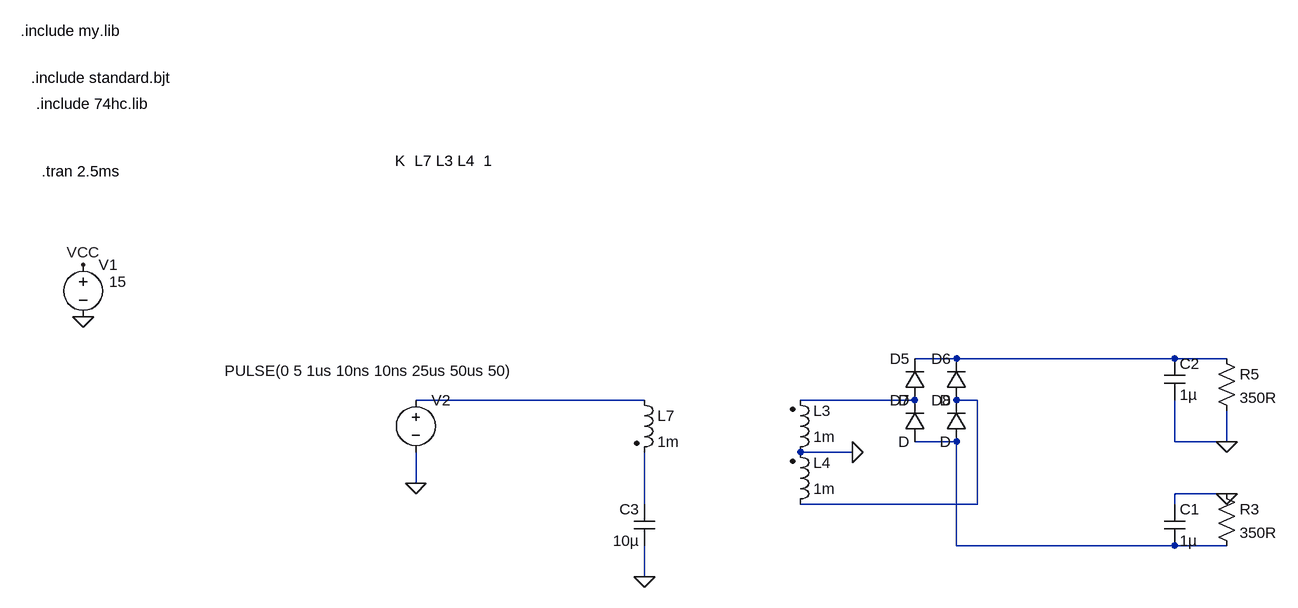
[diagram p0: schematic Draft24.asc]
Draft24.asc, the LTspice schematic file:
Version 4
SHEET 1 5720 1740
WIRE 1984 -192 1920 -192
WIRE 2320 -192 1984 -192
WIRE 2400 -192 2320 -192
WIRE 1504 -128 1152 -128
WIRE 1920 -128 1744 -128
WIRE 2016 -128 1984 -128
WIRE 1984 -64 1920 -64
WIRE 2320 -64 2320 -128
WIRE 2400 -64 2400 -112
WIRE 2400 -64 2320 -64
WIRE 1824 -48 1744 -48
WIRE 1152 0 1152 -48
WIRE 2400 16 2320 16
WIRE 1504 32 1504 -48
WIRE 2016 32 2016 -128
WIRE 2016 32 1744 32
WIRE 2320 32 2320 16
WIRE 1984 96 1984 -64
WIRE 2320 96 1984 96
WIRE 2400 96 2320 96
WIRE 1504 144 1504 96
FLAG 2400 -64 0
FLAG 1824 -48 0
FLAG 2400 16 0
FLAG 640 -256 0
FLAG 640 -336 VCC
FLAG 1504 144 0
FLAG 1152 0 0
SYMBOL ind2 1728 -32 M180
WINDOW 0 36 80 Left 2
WINDOW 3 36 40 Left 2
SYMATTR InstName L3
SYMATTR Value 1m
SYMATTR Type ind
SYMBOL diode 1936 -128 R180
WINDOW 0 24 64 Left 2
WINDOW 3 24 0 Left 2
SYMATTR InstName D5
SYMBOL diode 2000 -128 R180
WINDOW 0 24 64 Left 2
WINDOW 3 24 0 Left 2
SYMATTR InstName D6
SYMBOL diode 1936 -64 R180
WINDOW 0 24 64 Left 2
WINDOW 3 24 0 Left 2
SYMATTR InstName D7
SYMBOL diode 2000 -64 R180
WINDOW 0 24 64 Left 2
WINDOW 3 24 0 Left 2
SYMATTR InstName D8
SYMBOL cap 2304 -192 R0
SYMATTR InstName C2
SYMATTR Value 1µ
SYMBOL res 2384 -208 R0
SYMATTR InstName R5
SYMATTR Value 350R
SYMBOL ind2 1728 48 M180
WINDOW 0 36 80 Left 2
WINDOW 3 36 40 Left 2
SYMATTR InstName L4
SYMATTR Value 1m
SYMATTR Type ind
SYMBOL cap 2304 32 R0
SYMATTR InstName C1
SYMATTR Value 1µ
SYMBOL res 2384 0 R0
SYMATTR InstName R3
SYMATTR Value 350R
SYMBOL voltage 640 -352 R0
WINDOW 123 0 0 Left 0
WINDOW 39 0 0 Left 0
WINDOW 3 40 42 Left 2
SYMATTR Value 15
SYMATTR InstName V1
SYMBOL ind2 1488 -144 R0
SYMATTR InstName L7
SYMATTR Value 1m
SYMATTR Type ind
SYMBOL voltage 1152 -144 R0
WINDOW 123 0 0 Left 0
WINDOW 39 0 0 Left 0
WINDOW 3 -294 -29 Left 2
SYMATTR Value PULSE(0 5 1us 10ns 10ns 25us 50us 50)
SYMATTR InstName V2
SYMBOL cap 1520 96 R180
WINDOW 0 24 56 Left 2
WINDOW 3 24 8 Left 2
SYMATTR InstName C3
SYMATTR Value 10µ
TEXT 576 -480 Left 2 !.tran 2.5ms
TEXT 1120 -496 Left 2 !K  L7 L3 L4  1
TEXT 560 -624 Left 2 !.include standard.bjt
TEXT 544 -696 Left 2 !.include my.lib
TEXT 568 -584 Left 2 !.include 74hc.lib

The netlist it stands for:
* Draft24.asc
L3 0 N003 1m
D5 N003 N001 D
D6 N004 N001 D
D7 N005 N003 D
D8 N005 N004 D
C2 N001 0 1µ
R5 N001 0 350R
L4 N004 0 1m
C1 0 N005 1µ
R3 0 N005 350R
V1 VCC 0 15
L7 N002 N006 1m
V2 N002 0 PULSE(0 5 1us 10ns 10ns 25us 50us 50)
C3 0 N006 10µ
.model D D
.lib standard.dio
.tran 2.5ms
K  L7 L3 L4  1
.include standard.bjt
.include my.lib
.include 74hc.lib
.backanno
.end